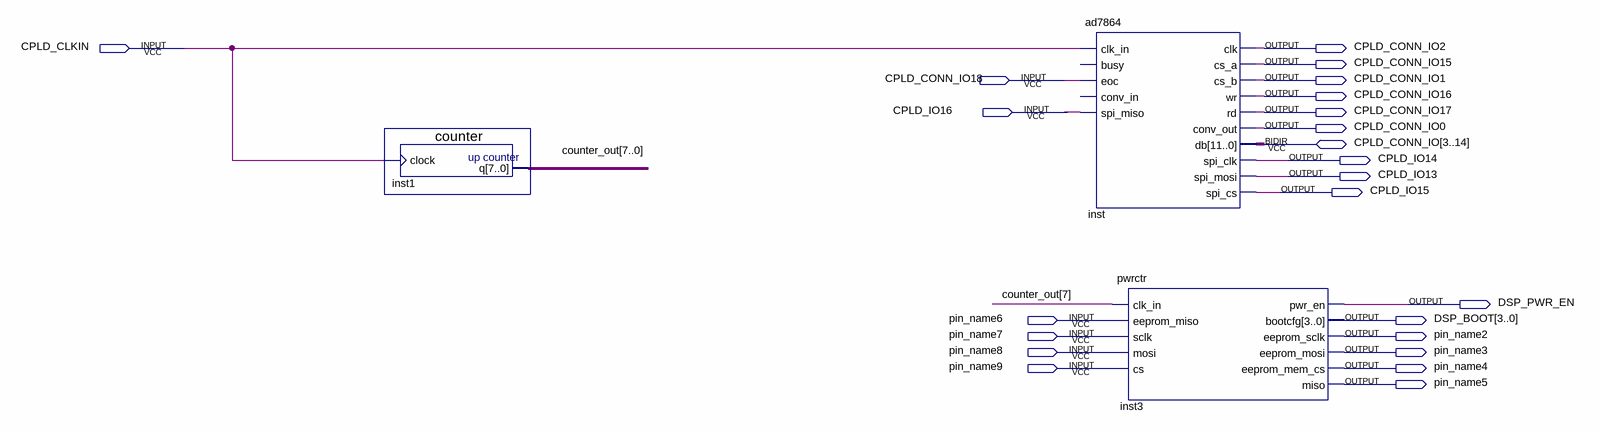
[diagram p0: schematic sheet]
// Quartus schematic cpld_beamforming_top.bdf as structural Verilog: 3 symbols, 23 pins
module cpld_beamforming_top (
  input  CPLD_CLKIN,
  input  CPLD_CONN_IO18,
  input  CPLD_IO16,
  input  pin_name6,
  input  pin_name7,
  input  pin_name8,
  input  pin_name9,
  inout  [3:14] CPLD_CONN_IO,
  output CPLD_CONN_IO2,
  output CPLD_CONN_IO15,
  output CPLD_CONN_IO1,
  output CPLD_CONN_IO16,
  output CPLD_CONN_IO17,
  output CPLD_CONN_IO0,
  output CPLD_IO14,
  output CPLD_IO13,
  output CPLD_IO15,
  output DSP_PWR_EN,
  output [3:0] DSP_BOOT,
  output pin_name2,
  output pin_name3,
  output pin_name4,
  output pin_name5
);

  wire [7:0] counter_out;

  counter inst1 (.clock(CPLD_CLKIN), .q(counter_out));
  ad7864 inst (
    .clk_in(CPLD_CLKIN), .eoc(CPLD_CONN_IO18), .spi_miso(CPLD_IO16), .clk(CPLD_CONN_IO2),
    .cs_a(CPLD_CONN_IO15), .cs_b(CPLD_CONN_IO1), .wr(CPLD_CONN_IO16), .rd(CPLD_CONN_IO17),
    .conv_out(CPLD_CONN_IO0), .spi_clk(CPLD_IO14), .spi_mosi(CPLD_IO13), .spi_cs(CPLD_IO15), .db(CPLD_CONN_IO));  // open: busy, conv_in
  pwrctr inst3 (
    .clk_in(counter_out[7]), .eeprom_miso(pin_name6), .sclk(pin_name7), .mosi(pin_name8), .cs(pin_name9),
    .pwr_en(DSP_PWR_EN), .bootcfg(DSP_BOOT), .eeprom_sclk(pin_name2), .eeprom_mosi(pin_name3),
    .eeprom_mem_cs(pin_name4), .miso(pin_name5));
endmodule
